# Altium schematic sheet Koruma.SchDoc (part 1 of 3)
size 431 x 279 mm; SheetNumber: 1; SheetTotal: 5
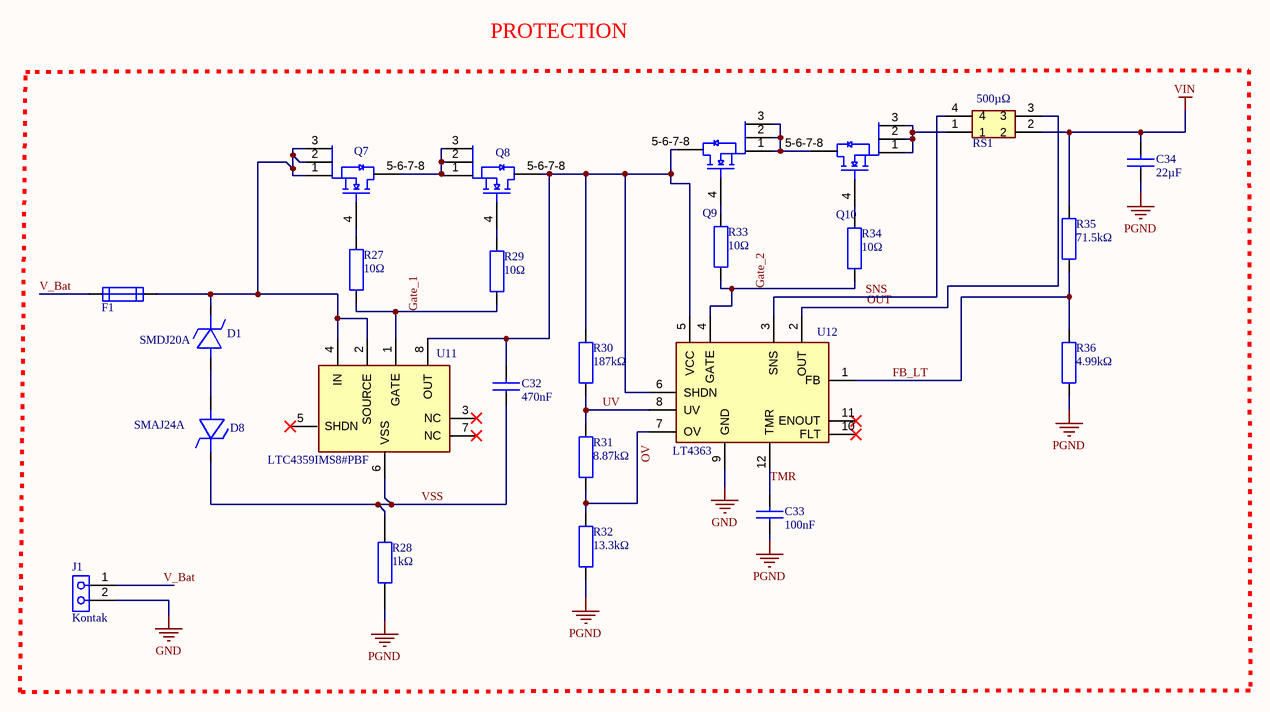
[diagram p0: Koruma.SchDoc]

## Parts
C32  value 470nF  [CAP 0603]  (hidden comment: W3F15C4738AT1F)
C33  value 100nF  [CAP 0402]  (hidden comment: GRM155R71C104KA88D)
C34  value 22µF  [CAP 2220]  (hidden comment: C5750X7R1H226M250KB)
D1  SMDJ20A  [SMC (DO-214AB)]
D8  SMAJ24A  [SMA (DO-214AC)]
F1  SF-3812F6000T-2  [SF-3812F6000T-2]  (value not drawn)
J1  Kontak  [TB 2pin]
Q7  BSC010N04LSI  [SON 5X6]  (value not drawn)
Q8  BSC010N04LSI  [SON 5X6]  (value not drawn)
Q9  BSC010N04LSI  [SON 5X6]  (value not drawn)
Q10  BSC010N04LSI  [SON 5X6]  (value not drawn)
R27  value 10Ω  [SR0805FR-7W10RL]  (hidden comment: SR0805FR-7W10RL)
R28  value 1kΩ  [RES 1206]  (hidden comment: SR1206FR-071KL)
R29  value 10Ω  [SR0805FR-7W10RL]  (hidden comment: SR0805FR-7W10RL)
R30  value 187kΩ  [RES 1206]  (hidden comment: RC0805FR-07187KL)
R31  value 8.87kΩ  [RES 1206]  (hidden comment: RC0805FR-078K87L)
R32  value 13.3kΩ  [RES 1206]  (hidden comment: RC0805FR-0713K3L)
R33  value 10Ω  [SR0805FR-7W10RL]  (hidden comment: SR0805FR-7W10RL)
R34  value 10Ω  [SR0805FR-7W10RL]  (hidden comment: SR0805FR-7W10RL)
R35  value 71.5kΩ  [RES 0603]  (hidden comment: RC0603FR-0771K5L)
R36  value 4.99kΩ  [RES 0402]  (hidden comment: ERJ-2RKF4991X)
RS1  value 500µΩ  [SR_4026]  (hidden comment: WSLP4026L5000FEA)
U11  LTC4359IMS8#PBF  [MSOP-8]
U12  LT4363  [MSOP-12]

## Nets
GND: J1.2 U12.9(GND)
PGND: C33.1 C34.1 R28.1 R32.1 R36.1
VIN: C34.2 R35.2 RS1.2
FB_LT: R35.1 R36.2 U12.1(FB)
Gate_1: R27.1 R29.1 U11.1(GATE)
Gate_2: R33.1 R34.1 U12.4(GATE)
OUT: RS1.3 U12.2(OUT)
OV: R31.1 R32.2 U12.7(OV)
SNS: RS1.4 U12.3(SNS)
TMR: C33.2 U12.12(TMR)
UV: R30.2 R31.2 U12.8(UV)
V_Bat: F1.1 J1.1
VSS: C32.1 D8.1 R28.2 U11.6(VSS)
NetC32_2: C32.2 Q8.5-6-7-8(D) Q9.5-6-7-8(D) R30.1 U11.8(OUT) U12.5(VCC) U12.6(SHDN)
NetD1_1: D1.1 F1.2 Q7.1(S) Q7.2(S) Q7.3(S) U11.2(SOURCE) U11.4(IN)
NetD1_2: D1.2 D8.2
NetQ7_4: Q7.4(G) R27.2
NetQ7_5-6-7-8: Q7.5-6-7-8(D) Q8.1(S) Q8.2(S) Q8.3(S)
NetQ8_4: Q8.4(G) R29.2
NetQ9_1: Q9.1(S) Q9.2(S) Q9.3(S) Q10.5-6-7-8(D)
NetQ9_4: Q9.4(G) R33.2
NetQ10_1: Q10.1(S) Q10.2(S) Q10.3(S) RS1.1
NetQ10_4: Q10.4(G) R34.2

Not connected (* = marked no-connect by the designer): U11 3(NC)* 5(SHDN)* 7(NC)*; U12 10(FLT)* 11(ENOUT)*

## Notes on the sheet
- PROTECTION
- DWG. NO.
- REV.
- SHT.
- THIS DOCUMENT AND THE DATA DISCLOSED HEREIN OR HEREWITH IS THE PROPERTY OF ALTIUM LIMITED AND MAY BE FREELY DISTRIBUTED IN WHOLE. NO RIGHTS ARE RESERVED OR EXPRESS OR IMPLIED WARANTEE GIVEN.
- REVISION
- DESCRIPTION
- DATE
- APPROVED
- ENG:
- APPROVALS
- PROJECT
- DSN:
- CHK:
- REFERENCE DOCUMENTS
- PROJECT REVISION:
- TITLE
- DOCUMENT REVISION:
- DESIGN ITEM:
- BOM:
- FAB DWG:
- PCB DWG:
- ASSY DWG:
- SCALE:
- SIZE
- B
- CAGE CODE
- FILE NAME
- DWG NO.
- SHEET
- OF
- REV